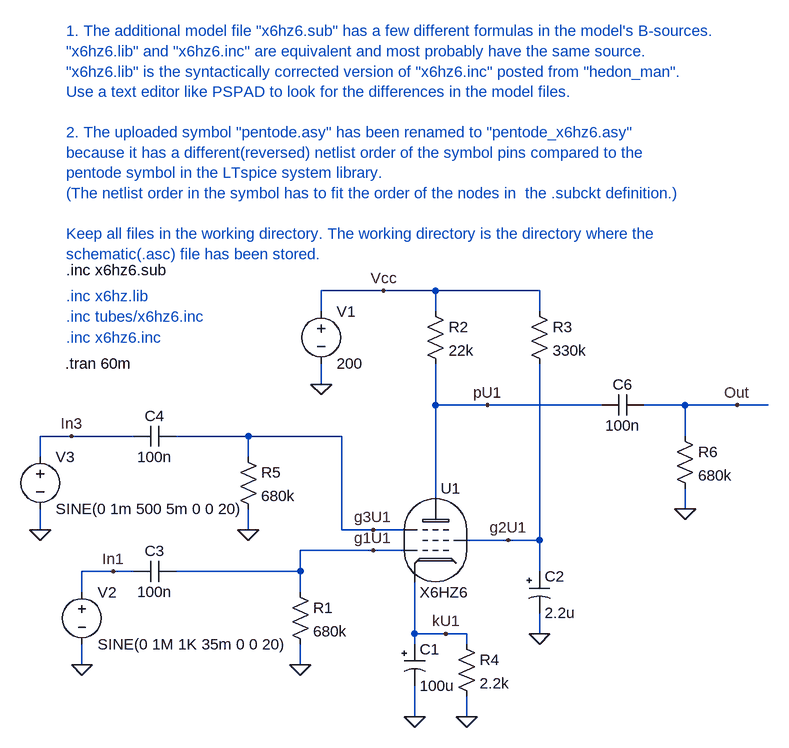
[diagram p0: schematic 6hz6test-2.asc]
6hz6test-2.asc, the LTspice schematic file:
Version 4
SHEET 1 880 680
WIRE -336 176 -336 144
WIRE -336 288 -336 256
WIRE -288 144 -336 144
WIRE -272 384 -272 352
WIRE -272 496 -272 464
WIRE -224 352 -272 352
WIRE -192 144 -288 144
WIRE -192 352 -224 352
WIRE -16 144 -128 144
WIRE -16 176 -16 144
WIRE -16 288 -16 256
WIRE 64 352 -128 352
WIRE 64 352 64 320
WIRE 64 384 64 352
WIRE 64 496 64 464
WIRE 96 -48 96 -80
WIRE 96 64 96 32
WIRE 128 144 -16 144
WIRE 128 288 128 144
WIRE 176 288 128 288
WIRE 176 320 64 320
WIRE 192 -80 96 -80
WIRE 224 288 176 288
WIRE 224 320 176 320
WIRE 240 448 240 368
WIRE 240 464 240 448
WIRE 240 576 240 528
WIRE 272 -80 192 -80
WIRE 272 -48 272 -80
WIRE 272 96 272 32
WIRE 272 240 272 96
WIRE 288 448 240 448
WIRE 320 448 288 448
WIRE 320 464 320 448
WIRE 320 576 320 544
WIRE 352 96 272 96
WIRE 384 304 320 304
WIRE 432 -80 272 -80
WIRE 432 -48 432 -80
WIRE 432 304 384 304
WIRE 432 304 432 32
WIRE 432 352 432 304
WIRE 432 448 432 416
WIRE 528 96 352 96
WIRE 656 96 592 96
WIRE 656 144 656 96
WIRE 656 256 656 224
WIRE 736 96 656 96
WIRE 784 96 736 96
FLAG -336 288 0
FLAG -272 496 0
FLAG 64 496 0
FLAG -16 288 0
FLAG 432 448 0
FLAG 320 576 0
FLAG 240 576 0
FLAG 656 256 0
FLAG 96 64 0
FLAG 736 96 Out
FLAG 192 -80 Vcc
FLAG 176 320 g1U1
FLAG 176 288 g3U1
FLAG 384 304 g2U1
FLAG 288 448 kU1
FLAG -224 352 In1
FLAG -288 144 In3
FLAG 352 96 pU1
SYMBOL res 48 368 R0
SYMATTR InstName R1
SYMATTR Value 680k
SYMATTR SpiceLine tol=5 pwr=0.5
SYMBOL res 256 -64 R0
SYMATTR InstName R2
SYMATTR Value 22k
SYMATTR SpiceLine tol=5 pwr=1
SYMBOL res 416 -64 R0
SYMATTR InstName R3
SYMATTR Value 330k
SYMATTR SpiceLine tol=5 pwr=2
SYMBOL res 304 448 R0
SYMATTR InstName R4
SYMATTR Value 2.2k
SYMATTR SpiceLine tol=5 pwr=0.5
SYMBOL polcap 224 464 R0
WINDOW 3 24 64 Left 0
SYMATTR Value 100u
SYMATTR InstName C1
SYMATTR Description Capacitor
SYMATTR Type cap
SYMATTR SpiceLine V=25 Irms=370m Rser=0.24 MTBF=2000 Lser=0 mfg="Nichicon" pn="UPL1E101MPH" type="Al electrolytic" ppPkg=1
SYMBOL polcap 416 352 R0
WINDOW 3 24 64 Left 0
SYMATTR Value 2.2u
SYMATTR InstName C2
SYMATTR Description Capacitor
SYMATTR Type cap
SYMATTR SpiceLine V=400 Irms=22m Rser=9.8 MTBF=1000 Lser=0 ppPkg=1
SYMBOL voltage 96 -64 R0
WINDOW 123 0 0 Left 0
WINDOW 39 0 0 Left 0
SYMATTR InstName V1
SYMATTR Value 200
SYMBOL voltage -272 368 R0
WINDOW 123 0 0 Left 0
WINDOW 39 0 0 Left 0
SYMATTR InstName V2
SYMATTR Value SINE(0 1M 1K 35m 0 0 20)
SYMBOL voltage -336 160 R0
WINDOW 123 0 0 Left 0
WINDOW 39 0 0 Left 0
SYMATTR InstName V3
SYMATTR Value SINE(0 1m 500 5m 0 0 20)
SYMBOL res -32 160 R0
SYMATTR InstName R5
SYMATTR Value 680k
SYMATTR SpiceLine tol=5 pwr=0.5
SYMBOL cap -128 128 R90
WINDOW 0 0 32 VBottom 0
WINDOW 3 32 32 VTop 0
SYMATTR InstName C4
SYMATTR Value 100n
SYMATTR SpiceLine V=100 Irms=7.25 Rser=0.004 MTBF=0 Lser=0 ppPkg=1
SYMBOL res 640 128 R0
SYMATTR InstName R6
SYMATTR Value 680k
SYMATTR SpiceLine tol=5 pwr=0.5
SYMBOL cap -128 336 R90
WINDOW 0 0 32 VBottom 0
WINDOW 3 32 32 VTop 0
SYMATTR InstName C3
SYMATTR Value 100n
SYMATTR SpiceLine V=100 Irms=7.25 Rser=0.004 MTBF=0 Lser=0 ppPkg=1
SYMBOL cap 592 80 R90
WINDOW 0 0 32 VBottom 0
WINDOW 3 32 32 VTop 0
SYMATTR InstName C6
SYMATTR Value 100n
SYMATTR SpiceLine V=100 Irms=7.25 Rser=0.004 MTBF=0 Lser=0 ppPkg=1
SYMBOL pentode_x6hz6 272 304 R0
SYMATTR InstName U1
TEXT -296 -8 Left 0 ;.inc x6hz6.inc
TEXT -298 32 Left 0 !.tran 60m
TEXT -296 -40 Left 0 ;.inc tubes/x6hz6.inc
TEXT -296 -72 Left 0 ;.inc x6hz.lib
TEXT -296 -112 Left 0 !.inc x6hz6.sub
TEXT -296 -480 Left 0 ;1. The additional model file "x6hz6.sub" has a few different formulas in the model's B-sources.\n"x6hz6.lib" and "x6hz6.inc" are equivalent and most probably have the same source.\n"x6hz6.lib" is the syntactically corrected version of "x6hz6.inc" posted from "hedon_man".\nUse a text editor like PSPAD to look for the differences in the model files. \n \n2. The uploaded symbol "pentode.asy" has been renamed to "pentode_x6hz6.asy" \nbecause it has a different(reversed) netlist order of the symbol pins compared to the \npentode symbol in the LTspice system library.  \n(The netlist order in the symbol has to fit the order of the nodes in  the .subckt definition.)\n \nKeep all files in the working directory. The working directory is the directory where the \nschematic(.asc) file has been stored.

The netlist it stands for:
* 6hz6test-2.asc
R1 g1U1 0 680k tol=5 pwr=0.5
R2 Vcc pU1 22k tol=5 pwr=1
R3 Vcc g2U1 330k tol=5 pwr=2
R4 kU1 0 2.2k tol=5 pwr=0.5
C1 kU1 0 100u V=25 Irms=370m Rser=0.24 MTBF=2000 Lser=0 mfg="Nichicon" pn="UPL1E101MPH" type="Al electrolytic" ppPkg=1
C2 g2U1 0 2.2u V=400 Irms=22m Rser=9.8 MTBF=1000 Lser=0 ppPkg=1
V1 Vcc 0 200
V2 In1 0 SINE(0 1M 1K 35m 0 0 20)
V3 In3 0 SINE(0 1m 500 5m 0 0 20)
R5 g3U1 0 680k tol=5 pwr=0.5
C4 g3U1 In3 100n V=100 Irms=7.25 Rser=0.004 MTBF=0 Lser=0 ppPkg=1
R6 Out 0 680k tol=5 pwr=0.5
C3 g1U1 In1 100n V=100 Irms=7.25 Rser=0.004 MTBF=0 Lser=0 ppPkg=1
C6 Out pU1 100n V=100 Irms=7.25 Rser=0.004 MTBF=0 Lser=0 ppPkg=1
XU1 pU1 g3U1 g2U1 g1U1 kU1 X6HZ6  ; pins Anode G3 G2 G1 Cathode
* .inc x6hz6.inc
.tran 60m
* .inc tubes/x6hz6.inc
* .inc x6hz.lib
.inc x6hz6.sub
* 1. The additional model file "x6hz6.sub" has a few different formulas in the model's B-sources.
* "x6hz6.lib" and "x6hz6.inc" are equivalent and most probably have the same source.
* "x6hz6.lib" is the syntactically corrected version of "x6hz6.inc" posted from "hedon_man".
* Use a text editor like PSPAD to look for the differences in the model files.
* 2. The uploaded symbol "pentode.asy" has been renamed to "pentode_x6hz6.asy"
* because it has a different(reversed) netlist order of the symbol pins compared to the
* pentode symbol in the LTspice system library.
* (The netlist order in the symbol has to fit the order of the nodes in  the .subckt definition.)
* Keep all files in the working directory. The working directory is the directory where the
* schematic(.asc) file has been stored.
.backanno
.end